# EAGLE design V2b (EAGLE 6.5.0)
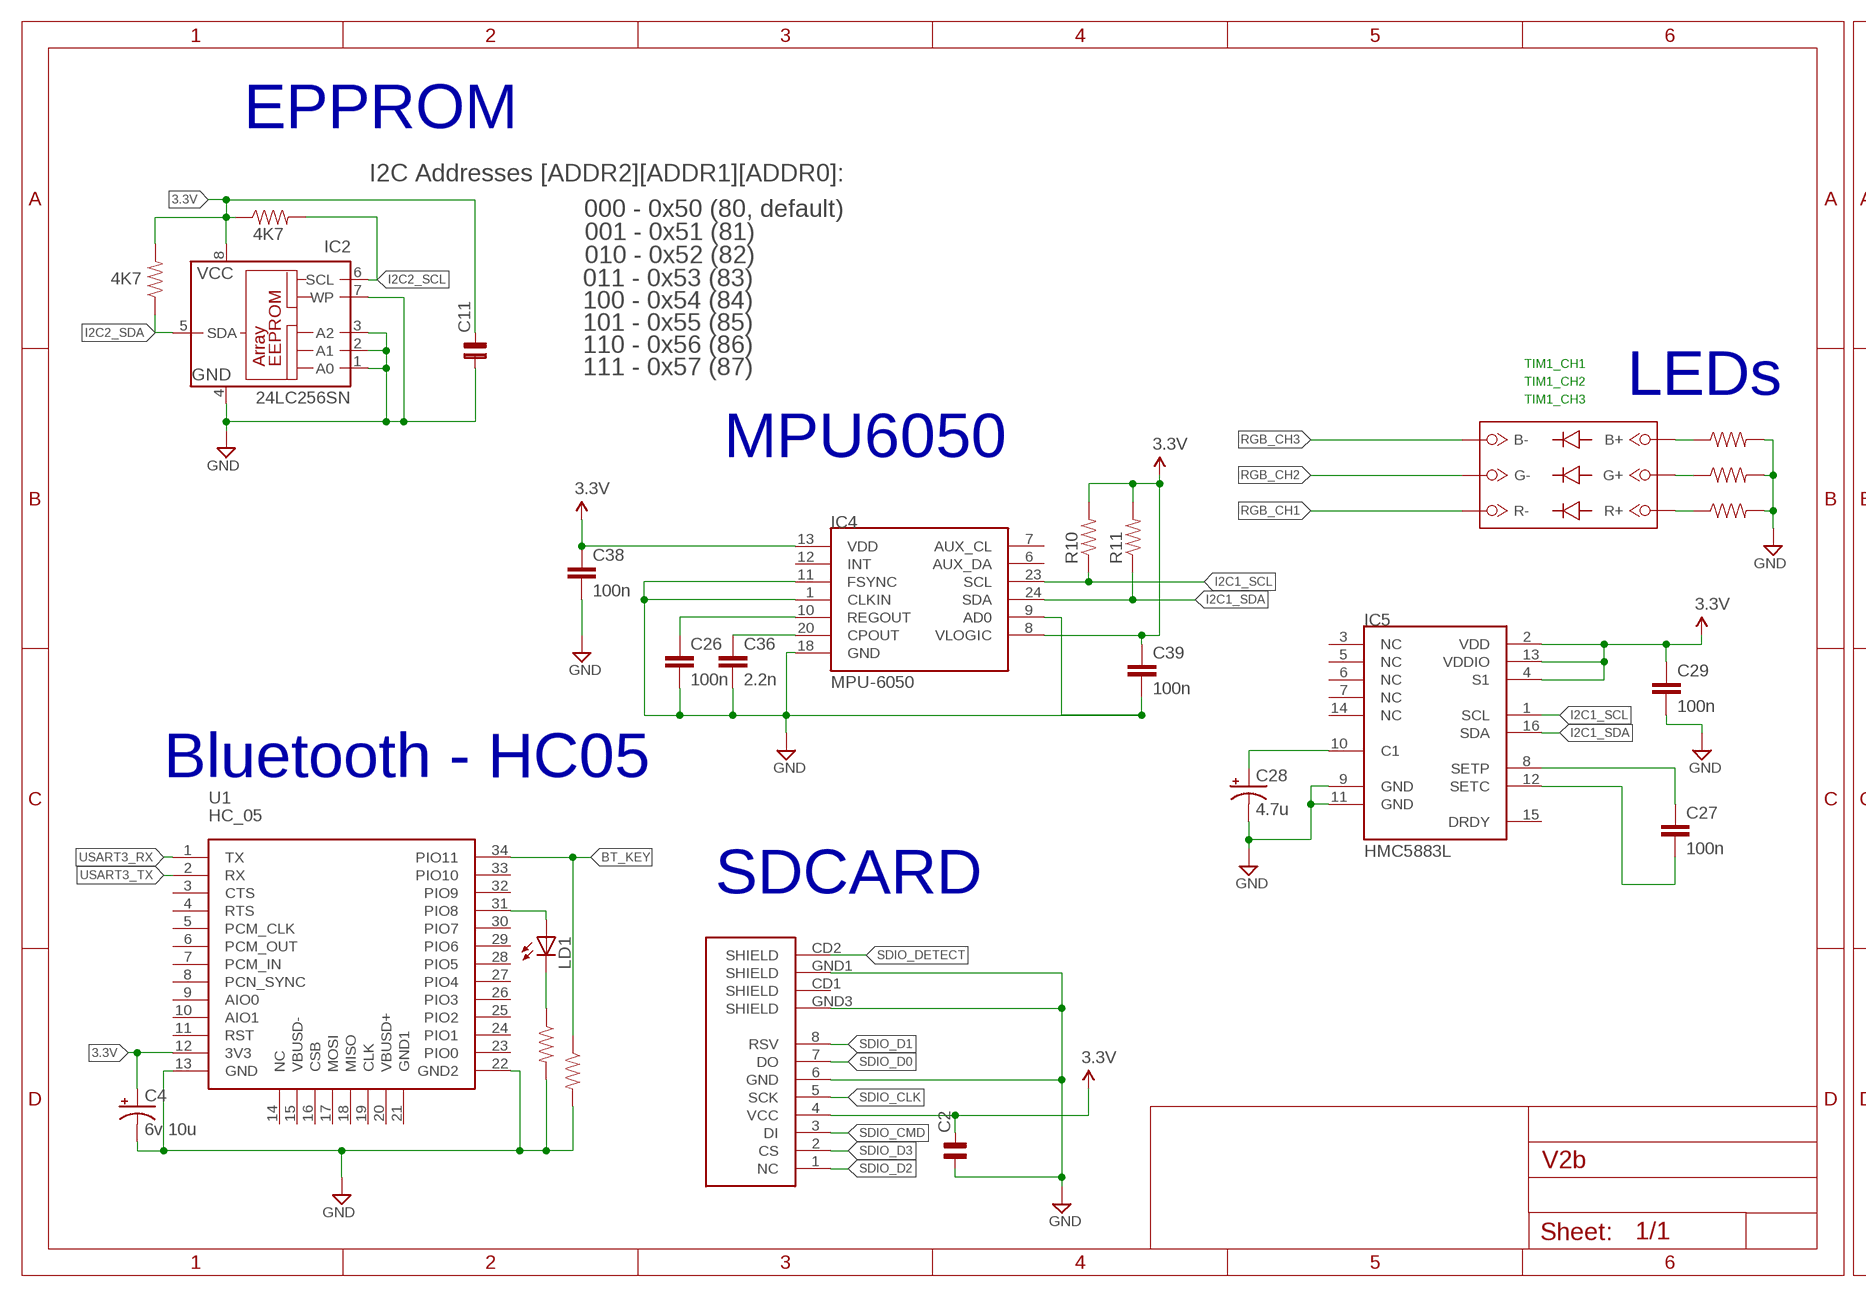
[diagram p0: schematic, sheet 1, part 1 of 2]
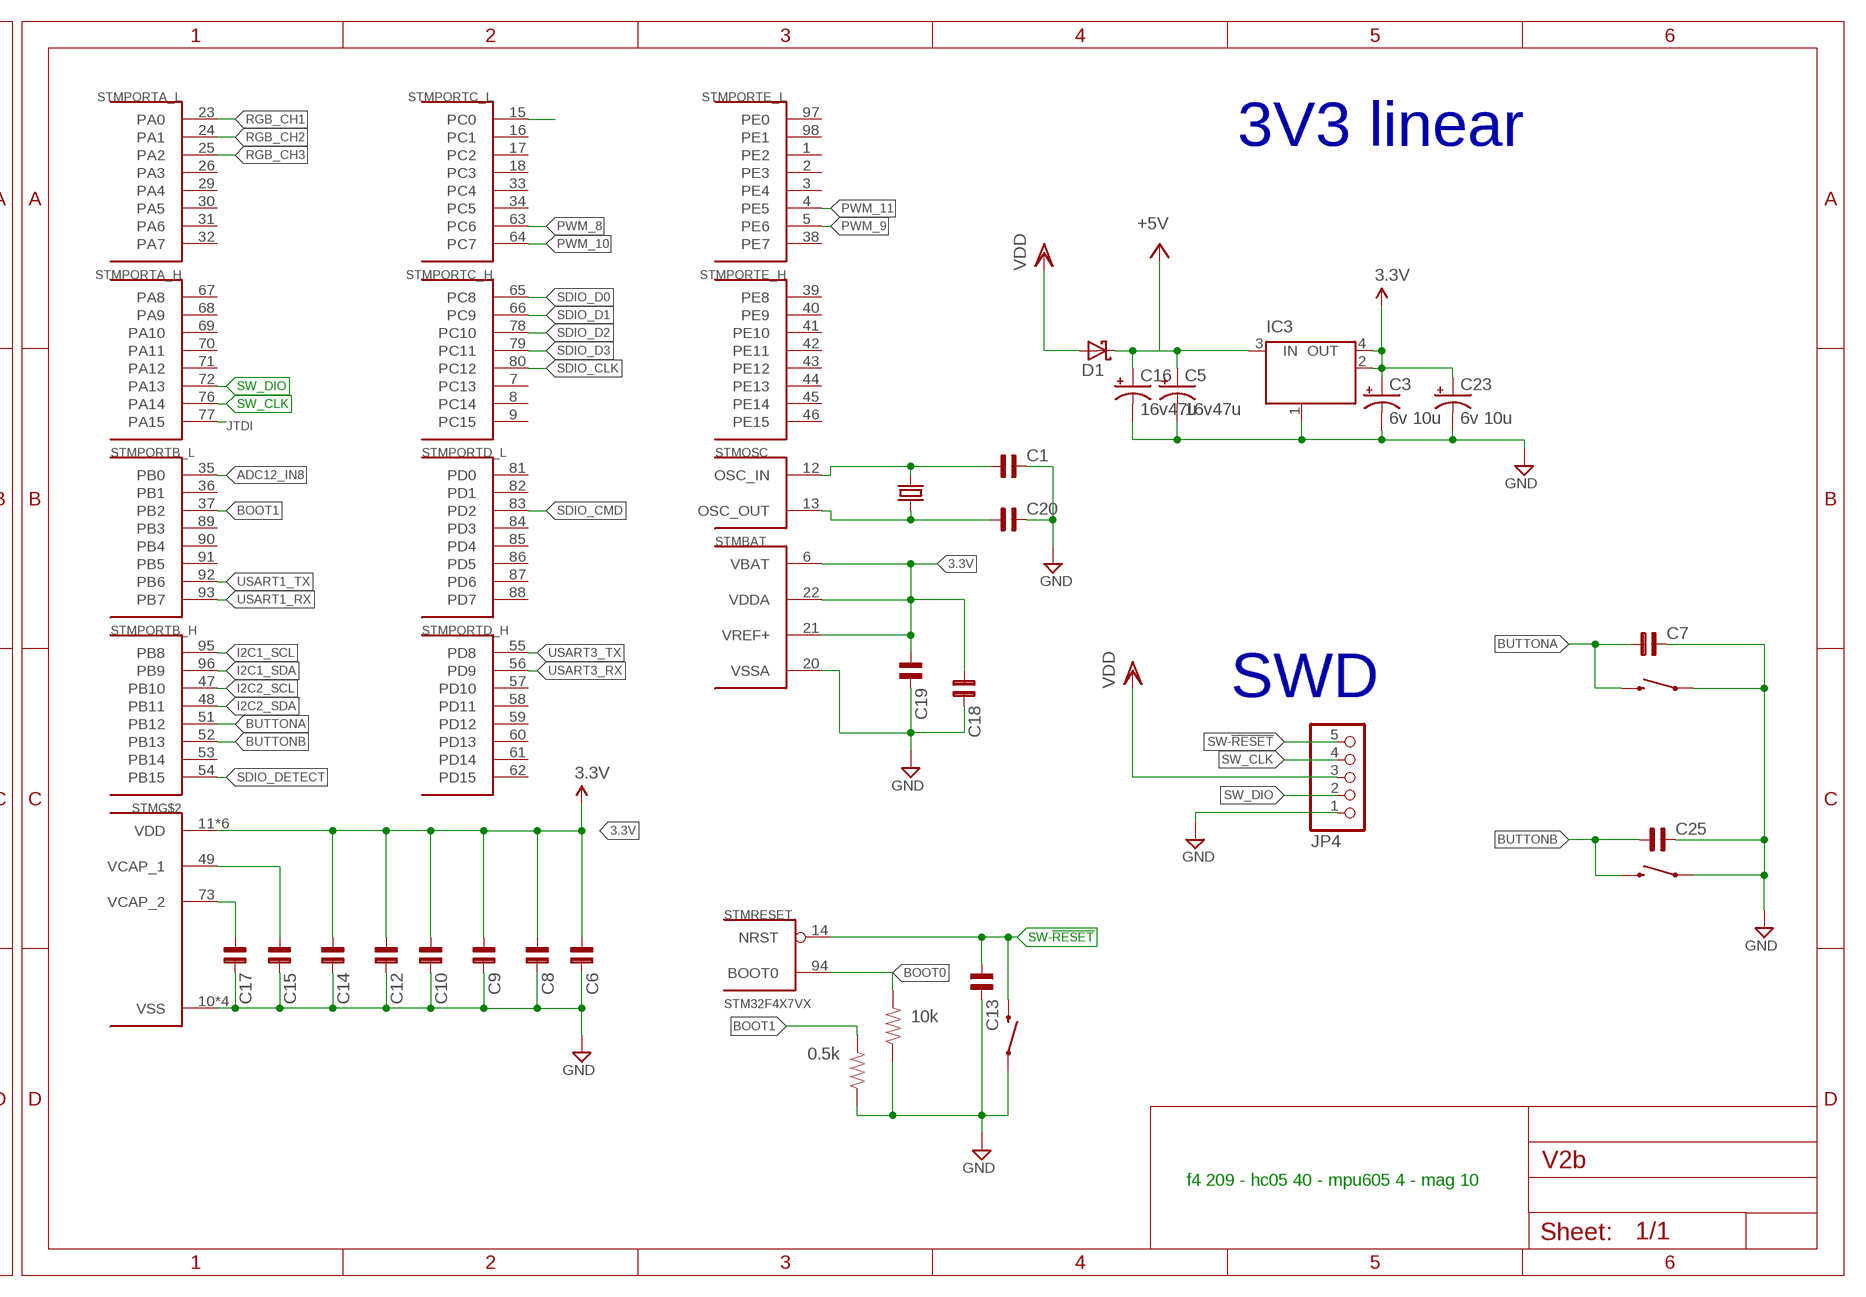
[diagram p1: schematic, sheet 1, part 2 of 2]

## Parts
C1  C-NP-SMD-0603  [C-0603]
C2  C-NP-SMD-0603  [C-0603]
C3  6v 10u  CPOL-USSMCC  [SMC_C]
C4  6v 10u  CPOL-USSMCA  [SMC_A]
C5  16v47u  CPOL-USSMCC  [SMC_C]
C6  C-NP-SMD-0603  [C-0603]
C7  C-NP-SMD-0603  [C-0603]
C8  C-NP-SMD-0603  [C-0603]
C9  C-NP-SMD-0603  [C-0603]
C10  C-NP-SMD-0603  [C-0603]
C11  C-NP-SMD-0603  [C-0603]
C12  C-NP-SMD-0603  [C-0603]
C13  C-NP-SMD-0603  [C-0603]
C14  C-NP-SMD-0603  [C-0603]
C15  C-NP-SMD-0603  [C-0603]
C16  16v47u  CPOL-USSMCC  [SMC_C]
C17  C-NP-SMD-0603  [C-0603]
C18  C-NP-SMD-0603  [C-0603]
C19  C-NP-SMD-0603  [C-0603]
C20  C-NP-SMD-0603  [C-0603]
C23  6v 10u  CPOL-USSMCC  [SMC_C]
C25  C-NP-SMD-0603  [C-0603]
C26  100n  SPARKFUN_CAP0603-CAP  [SPARKFUN_0603-CAP]
C27  100n  SPARKFUN_CAP0603-CAP  [SPARKFUN_0603-CAP]
C28  4.7u  CPOL-USSMCA  [SMC_A]
C29  100n  SPARKFUN_CAP0603-CAP  [SPARKFUN_0603-CAP]
C36  2.2n  SPARKFUN_CAP0603-CAP  [SPARKFUN_0603-CAP]
C38  100n  SPARKFUN_CAP0603-CAP  [SPARKFUN_0603-CAP]
C39  100n  SPARKFUN_CAP0603-CAP  [SPARKFUN_0603-CAP]
D1  MBRS330T3  [SMC]
IC2  24LC256SN  [SO-08]
IC3  LINEAR_MC33269ST-3.3T3  [LINEAR_SOT223]
IC4  MPU-6050  TESTING_MPU-6050-1  [TESTING_QFN-24-4MM2]
IC5  HMC5883L  SPARKFUN_HMC5883LSMD  [SPARKFUN_16LPCC]
JP4  PINHD-1X5_2.54-90°  [1X05/90]
LD1  LEDCHIPLED_0603  [CHIPLED_0603]
R2  10K  SPARKFUN_RESISTOR0603-RES  [SPARKFUN_0603-RES]
R3  10K  SPARKFUN_RESISTOR0603-RES  [SPARKFUN_0603-RES]
R5  10K  SPARKFUN_RESISTOR0603-RES  [SPARKFUN_0603-RES]
R6  10K  SPARKFUN_RESISTOR0603-RES  [SPARKFUN_0603-RES]
R7  10k  SPARKFUN_RESISTOR0603-RES  [SPARKFUN_0603-RES]
R8  0.5k  SPARKFUN_RESISTOR0603-RES  [SPARKFUN_0603-RES]
R9  10K  SPARKFUN_RESISTOR0603-RES  [SPARKFUN_0603-RES]
R10  SPARKFUN_RESISTOR0603-RES  [SPARKFUN_0603-RES]
R11  SPARKFUN_RESISTOR0603-RES  [SPARKFUN_0603-RES]
R15  4K7  SPARKFUN_RESISTOR0603-RES  [SPARKFUN_0603-RES]
R16  4K7  SPARKFUN_RESISTOR0603-RES  [SPARKFUN_0603-RES]
S1  RESET  SWITCH-MOMENTARY-2-SMD-1101NE  [TACTILE-SWITCH-1101NE]
S2  RESET  SWITCH-MOMENTARY-2-SMD-1101NE  [TACTILE-SWITCH-1101NE]
S4  RESET  SWITCH-MOMENTARY-2-SMD-1101NE  [TACTILE-SWITCH-1101NE]
SDCARD2  microSD Socket  USD-SOCKETNEW  [MICRO-SD-SOCKET-PP]
STM  STM32F4X7VX  [TQFP100]
U1  HC_05  [BLUETOOTH_SMD]
U$12  RGB_LED  [SMD]
Y1  CRYSTALHC49US  [HC49US]

## Nets
3.3V: C2.2 C3.+ C4.+ C6.1 C8.1 C9.1 C10.1 C11.2 C12.1 C14.1 C18.1 C19.1 C23.+ C29.1 C38.1 C39.1 IC2.8(VCC) IC3.2(OUT) IC3.4(OUT) IC4.8(VLOGIC) IC4.13(VDD) IC5.2(VDD) IC5.4(S1) IC5.13(VDDIO) R10.2 R11.2 R15.1 R16.2 SDCARD2.4(VCC) STM.6(BAT:VBAT) STM.11(VDD) STM.19(VDD) STM.21(BAT:VREF+) STM.22(BAT:VDDA) STM.28(VDD) STM.50(VDD) STM.75(VDD) STM.100(VDD) U1.12(3V3)
+5V: C5.+ C16.+ D1.C IC3.3(IN)
ADC12_IN8: STM.35(PORTB_L:PB0)
BOOT0: R7.2 STM.94(RESET:BOOT0)
BOOT1: R8.2 STM.37(PORTB_L:PB2)
BT_KEY: R5.1 U1.34(PIO11)
BUTTONA: C7.1 S4.P$2 STM.51(PORTB_H:PB12)
BUTTONB: C25.1 S2.P$2 STM.52(PORTB_H:PB13)
GND: C1.2 C2.1 C3.- C4.- C5.- C6.2 C7.2 C8.2 C9.2 C10.2 C11.1 C12.2 C13.2 C14.2 C15.2 C16.- C17.2 C18.2 C19.2 C20.2 C23.- C25.2 C26.2 C28.- C29.2 C36.2 C38.2 C39.2 IC2.1(A0) IC2.2(A1) IC2.3(A2) IC2.4(GND) IC2.7(WP) IC3.1(GND/ADJ) IC4.1(CLKIN) IC4.9(AD0) IC4.11(FSYNC) IC4.18(GND) IC5.9(GND) IC5.11(GND) JP4.1 R2.2 R3.2 R5.2 R6.2 R7.1 R8.1 R9.2 S1.P$1 S2.P$1 S4.P$1 SDCARD2.6(GND) SDCARD2.GND1(SHIELD) SDCARD2.GND3(SHIELD) STM.10(VSS) STM.20(BAT:VSSA) STM.27(VSS) STM.74(VSS) STM.99(VSS) U1.13(GND) U1.22(GND2)
I2C1_SCL: IC4.23(SCL) IC5.1(SCL) R10.1 STM.95(PORTB_H:PB8)
I2C1_SDA: IC4.24(SDA) IC5.16(SDA) R11.1 STM.96(PORTB_H:PB9)
I2C2_SCL: IC2.6(SCL) R15.2 STM.47(PORTB_H:PB10)
I2C2_SDA: IC2.5(SDA) R16.1 STM.48(PORTB_H:PB11)
JTDI: STM.77(PORTA_H:PA15)
N$1: C1.1 STM.12(OSC:OSC_IN) Y1.2
N$2: R2.1 U$12.B+
N$3: C26.1 IC4.10(REGOUT)
N$4: LD1.A U1.31(PIO8)
N$5: LD1.C R9.1
N$6: R6.1 U$12.R+
N$7: R3.1 U$12.G+
N$8: C36.1 IC4.20(CPOUT)
N$9: STM.15(PORTC_L:PC0)
N$10: C27.1 IC5.8(SETP)
N$12: C28.+ IC5.10(C1)
N$13: C27.2 IC5.12(SETC)
N$29: C20.1 STM.13(OSC:OSC_OUT) Y1.1
N$31: C17.1 STM.73(VCAP_2)
N$32: C15.1 STM.49(VCAP_1)
PWM_8: STM.63(PORTC_L:PC6)
PWM_9: STM.5(PORTE_L:PE6)
PWM_10: STM.64(PORTC_L:PC7)
PWM_11: STM.4(PORTE_L:PE5)
RGB_CH1: STM.23(PORTA_L:PA0) U$12.R-
RGB_CH2: STM.24(PORTA_L:PA1) U$12.G-
RGB_CH3: STM.25(PORTA_L:PA2) U$12.B-
SDIO_CLK: SDCARD2.5(SCK) STM.80(PORTC_H:PC12)
SDIO_CMD: SDCARD2.3(DI) STM.83(PORTD_L:PD2)
SDIO_D0: SDCARD2.7(DO) STM.65(PORTC_H:PC8)
SDIO_D1: SDCARD2.8(RSV) STM.66(PORTC_H:PC9)
SDIO_D2: SDCARD2.1(NC) STM.78(PORTC_H:PC10)
SDIO_D3: SDCARD2.2(CS) STM.79(PORTC_H:PC11)
SDIO_DETECT: SDCARD2.CD2(SHIELD) STM.54(PORTB_H:PB15)
SW-!RESET: C13.1 JP4.5 S1.P$2 STM.14(RESET:NRST)
SW_CLK: JP4.4 STM.76(PORTA_H:PA14)
SW_DIO: JP4.2 STM.72(PORTA_H:PA13)
USART1_RX: STM.93(PORTB_L:PB7)
USART1_TX: STM.92(PORTB_L:PB6)
USART3_RX: STM.56(PORTD_H:PD9) U1.1(TX)
USART3_TX: STM.55(PORTD_H:PD8) U1.2(RX)
VDD: D1.A JP4.3
Unconnected: IC4.6(AUX_DA) IC4.7(AUX_CL) IC4.12(INT) IC5.3(NC) IC5.5(NC) IC5.6(NC) IC5.7(NC) IC5.14(NC) IC5.15(DRDY) SDCARD2.CD1(SHIELD) STM.1(PORTE_L:PE2) STM.2(PORTE_L:PE3) STM.3(PORTE_L:PE4) STM.7(PORTC_H:PC13) STM.8(PORTC_H:PC14) STM.9(PORTC_H:PC15) STM.16(PORTC_L:PC1) STM.17(PORTC_L:PC2) STM.18(PORTC_L:PC3) STM.26(PORTA_L:PA3) STM.29(PORTA_L:PA4) STM.30(PORTA_L:PA5) STM.31(PORTA_L:PA6) STM.32(PORTA_L:PA7) STM.33(PORTC_L:PC4) STM.34(PORTC_L:PC5) STM.36(PORTB_L:PB1) STM.38(PORTE_L:PE7) STM.39(PORTE_H:PE8) STM.40(PORTE_H:PE9) STM.41(PORTE_H:PE10) STM.42(PORTE_H:PE11) STM.43(PORTE_H:PE12) STM.44(PORTE_H:PE13) STM.45(PORTE_H:PE14) STM.46(PORTE_H:PE15) STM.53(PORTB_H:PB14) STM.57(PORTD_H:PD10) STM.58(PORTD_H:PD11) STM.59(PORTD_H:PD12) STM.60(PORTD_H:PD13) STM.61(PORTD_H:PD14) STM.62(PORTD_H:PD15) STM.67(PORTA_H:PA8) STM.68(PORTA_H:PA9) STM.69(PORTA_H:PA10) STM.70(PORTA_H:PA11) STM.71(PORTA_H:PA12) STM.81(PORTD_L:PD0) STM.82(PORTD_L:PD1) STM.84(PORTD_L:PD3) STM.85(PORTD_L:PD4) STM.86(PORTD_L:PD5) STM.87(PORTD_L:PD6) STM.88(PORTD_L:PD7) STM.89(PORTB_L:PB3) STM.90(PORTB_L:PB4) STM.91(PORTB_L:PB5) STM.97(PORTE_L:PE0) STM.98(PORTE_L:PE1) U1.3(CTS) U1.4(RTS) U1.5(PCM_CLK) U1.6(PCM_OUT) U1.7(PCM_IN) U1.8(PCN_SYNC) U1.9(AIO0) U1.10(AIO1) U1.11(RST) U1.14(NC) U1.15(VBUSD-) U1.16(CSB) U1.17(MOSI) U1.18(MISO) U1.19(CLK) U1.20(VBUSD+) U1.21(GND1) U1.23(PIO0) U1.24(PIO1) U1.25(PIO2) U1.26(PIO3) U1.27(PIO4) U1.28(PIO5) U1.29(PIO6) U1.30(PIO7) U1.32(PIO9) U1.33(PIO10)

## Notes on the sheet
- EPPROM | 3V3 linear
- I2C Addresses [ADDR2][ADDR1][ADDR0]:
- 000 - 0x50 (80, default)
- 001 - 0x51 (81)
- 010 - 0x52 (82)
- 011 - 0x53 (83)
- 100 - 0x54 (84)
- 101 - 0x55 (85)
- 110 - 0x56 (86)
- TIM1_CH1
- 111 - 0x57 (87)
- TIM1_CH2
- LEDs
- TIM1_CH3
- MPU6050
- SWD
- Bluetooth - HC05
- SDCARD
- f4 209 - hc05 40 - mpu605 4 - mag 10
- TJA1040

## Library data of the parts
C1 C2 C6-C15 C17-C20 C25 = cap-pan40:C-NP: NON-POLARIZED FILM/CHIP
C3-C5 C16 C23 C28 = rcl:CPOL-US: POLARIZED CAPACITOR, American symbol
C26 C27 C29 C36 C38 C39 = Helios_RLC:SPARKFUN_CAP: Capacitor Standard 0603 ceramic capacitor, and 0.1" leaded capacitor.
D1 = Robotech Diode of Chung:MBRS3*0T3: SCHOTTKY BARRIER RECTIFIER 3.0 AMPERES 20, 30, 40 VOLT Source: MBRS340T3-D.pdf
IC2 = microchip:24*: Serial EEPROM I2C; DIGIKEY: 24LC256-E/SN-ND; MF: MICROCHIP; MPN: 24LC256-I/SN; OC_FARNELL: 9757996; OC_NEWARK: 27C9144
IC3 = Robotech_Other:LINEAR_MC33269ST*: Adjustable Output Low Dropout Voltage Regulator 800 mA Source: http://www.onsemi.com/pub/Collateral/MC33269-D.PDF
IC4 = Helios_IMU:TESTING_MPU-6050
IC5 = Helios_IMU:SPARKFUN_HMC5883L: 3 Axis Digital Compass IC
JP4 = pinhead-1:PINHD-1X5: PIN HEADER
LD1 = led:LED: LED OSRAM: - CHIPLED LG R971, LG N971, LY N971, LG Q971, LY Q971, LO R971, LY R971 LH N974, LH R974 LS Q976, LO Q976, LY Q976 LO Q996 - Hyper CHIPLED LW Q18S LB Q993, LB Q99A, LB R99A - SideLED LS A670, LO A670, LY A670, LG A670, LP A670 LB A673, LV A673, LT A673, LW A673 LH A674 LY A675 LS A676, LA A676, LO A676, LY A676, LW A676 LS A679, LY A679, LG A679 - Hyper Micro SIDELED® LS Y876, LA Y876, LO Y876, LY Y876 LT Y87S - SmartLED LW L88C, LW L88S LB L89C, LB L89S, LG L890 LS L89K, LO L89K, LY L89K LS L896, LA L896, LO L896, LY L896 - TOPLED LS T670, LO T670, LY T670, LG T670, LP T670 LSG T670, LSP T670, LSY T670, LOP T670, LYG T670 LG T671, LOG T671, LSG T671 LB T673, LV T673, LT T673, LW T673 LH T674 LS T676, LA T676, LO T676, LY T676, LB T676, LH T676, LSB T676, LW T676 LB T67C, LV T67C, LT T67C, LS T67K, LO T67K, LY T67K, LW E67C LS E67B, LA E67B, LO E67B, LY E67B, LB E67C, LV E67C, LT E67C LW T67C LS T679, LY T679, LG T679 LS T770, LO T770, LY T770, LG T770, LP T770 LB T773, LV T773, LT T773, LW T773 LH T774 LS E675, LA E675, LY E675, LS T675 LS T776, LA T776, LO T776, LY T776, LB T776 LHGB T686 LT T68C, LB T68C - Hyper Mini TOPLED® LB M676 - Mini TOPLED Santana® LG M470 LS M47K, LO M47K, LY M47K Source: http://www.osram.convergy.de/
R2 R3 R5-R9 R15 R16 = Robotech_RCL:SPARKFUN_RESISTOR: Resistor Basic schematic elements and footprints for 0603, 1206, and PTH resistors.
R10 R11 = Helios_RLC:SPARKFUN_RESISTOR: Resistor Basic schematic elements and footprints for 0603, 1206, and PTH resistors.
S1 S2 S4 = pixhawk2:SWITCH-MOMENTARY-2; PARTNO: EVQ-P7J01P
SDCARD2 = SparkFun:USD-SOCKET: microSD Socket Push-push type uSD socket. Schematic element and footprint production proven. Spark Fun Electronics SKU : PRT-00127. tDoc lines correctly indicate media card edge positions when inserting (unlocked, locked, depressed).
STM = pixhawk2:STM32F4X7VX: STM32F4X7VX 100 pin LQFP STM32F407VE - 512 KB flash, no crypto STM32F407VG - 1 MB flash, no crypto STM32F417VE - 512 KB flash, with crypto STM32F417VG - 1 MB flash, with crypto; PARTNO: STM32F427VI
U1 = SerialPortBluetooth:HC_05
U$12 = RGB_LED:RGB_LED
Y1 = SparkFun-FreqCtrl:CRYSTAL: Various standard crystals. Proven footprints. Spark Fun Electronics SKU : COM-00534

## Net classes
1 power: width 0.15 mm, drill 0.2 mm, clearance 0.152 mm

## Board
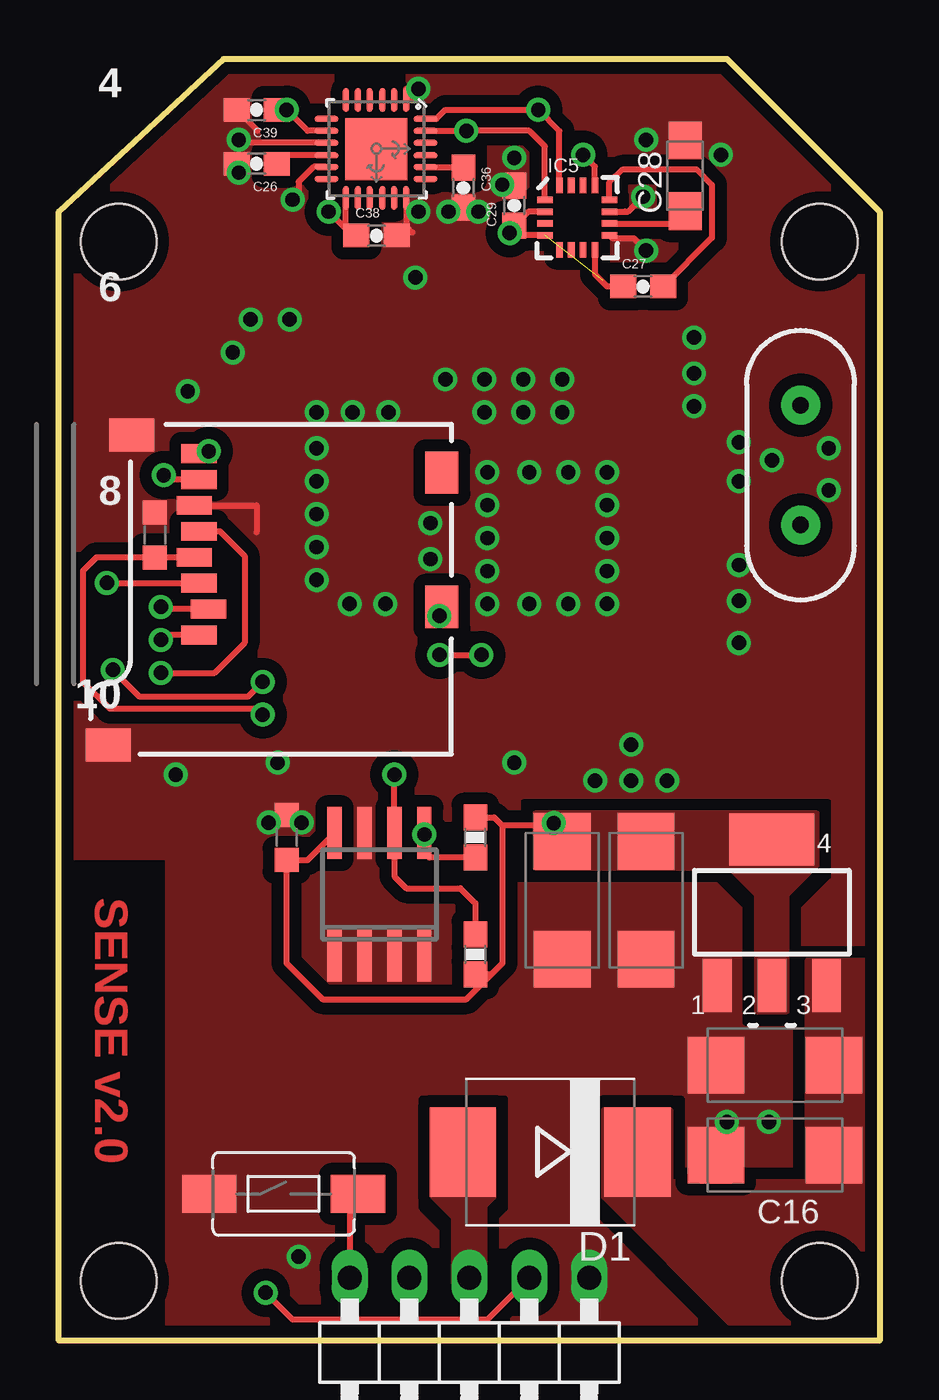
[diagram p2: board, top side]
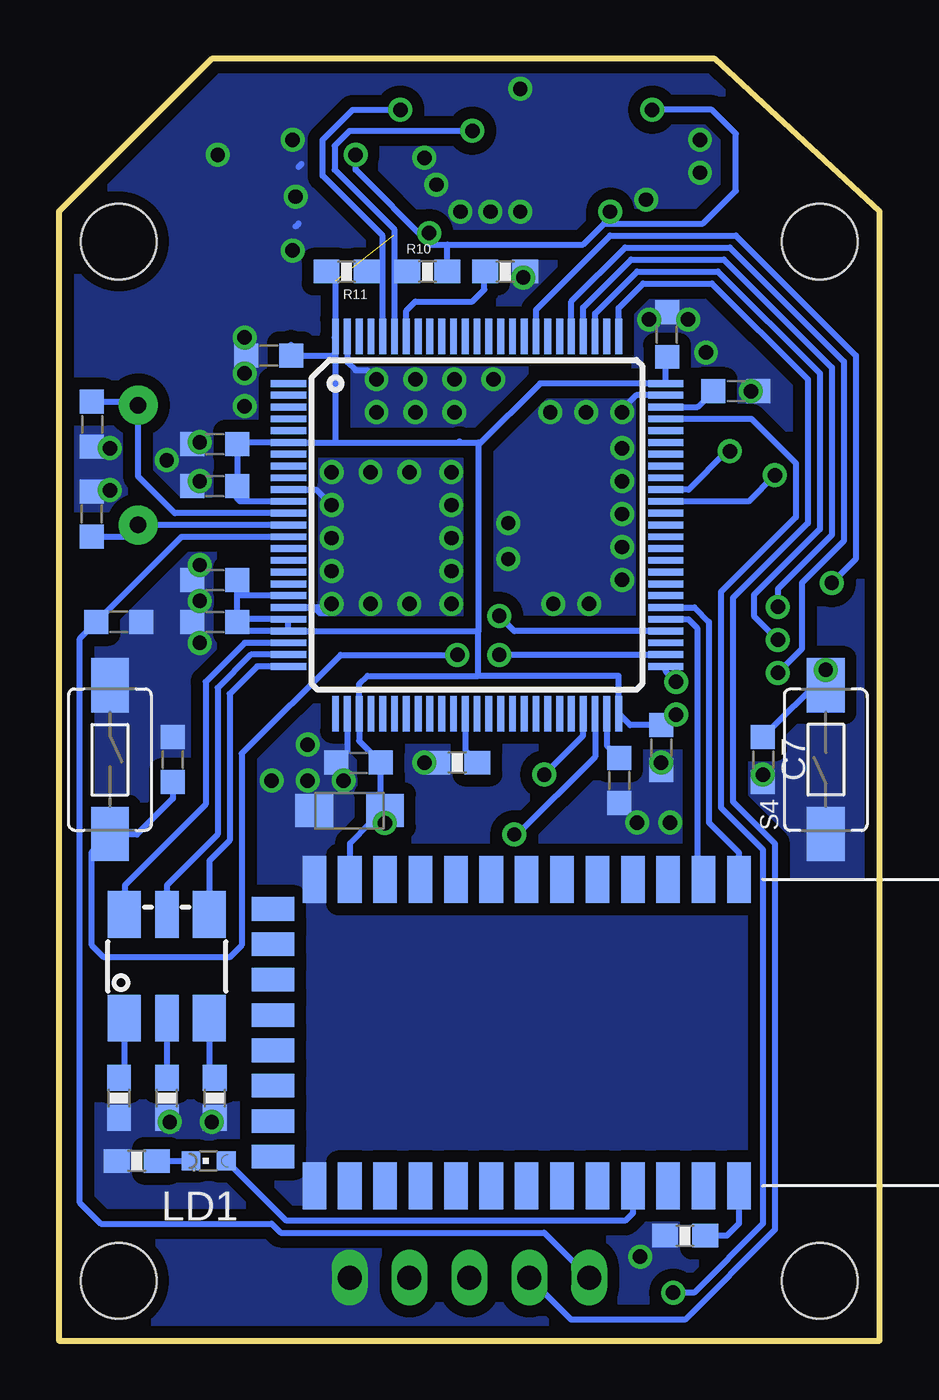
[diagram p3: board, bottom side, seen from below]

Size 34.8 x 54.36 mm. Coordinates in mm from the lower left corner, seen from the top.
Outline: 34.8,0 0,0 0,47.88 6.99,54.36 28.32,54.36 34.8,47.88 34.8,0
Copper layers (1*16): Top 0.035mm / dielectric 1.5mm / Bottom 0.035mm
Design rules "default *": minimum track width 10mil, minimum drill 24mil, track to track 8mil, track to pad 8mil, pad to pad 8mil, via to via 10mil, smd to smd 8mil, copper to edge 20mil, drill to drill 10mil, minimum pad ring 10mil, minimum via ring 8mil, stop-mask expansion 0mil, vias tented up to drill 100mil, thermal gap 10mil
Holes 3.2 mm at 2.54,2.54 2.54,46.61 32.26,46.61 32.26,2.54
bKeepout: area -1,43.1 to 6,50.1; area -1,-1 to 6,6; area 28.8,-1 to 35.8,6; area 28.8,43.1 to 35.8,50.1

### Footprints (pad centres in the part's own frame; a part is rotated, then mirrored left to right if it is on the bottom)
C-0603 = smd 1.016 x 1.016: 1 -0.953,0; 2 0.953,0
SMC_C = smd 2.4 x 2.4: + -2.5,0; - 2.5,0
SMC_A = smd 1.6 x 1.4: + -1.5,0; - 1.5,0
SPARKFUN_0603-CAP = smd 1.1 x 1: 1 -0.85,0; 2 0.85,0
SMC = smd 2.8 x 3.8: A 3.7,0; C -3.7,0
SO-08 = smd 0.6 x 2.2: 1 -1.905,-2.6; 2 -0.635,-2.6; 3 0.635,-2.6; 4 1.905,-2.6; 5 1.905,2.6; 6 0.635,2.6; 7 -0.635,2.6; 8 -1.905,2.6
LINEAR_SOT223 = smd 1.219 x 2.235: 1 -2.311,-3.099; 2 0,-3.099; 3 2.311,-3.099 | smd 3.6 x 2.2: 4 0,3.099
TESTING_QFN-24-4MM2 = smd 1.016 x 0.254: 1 -2.066,1.257; 2 -2.066,0.75; 3 -2.066,0.247; 4 -2.066,-0.287; 5 -2.066,-0.792; 6 -2.066,-1.297; 13 2.086,-1.297; 14 2.086,-0.792; 15 2.086,-0.287; 16 2.086,0.247; 17 2.086,0.75; 18 2.086,1.257 | smd 0.254 x 1.016: 7 -1.267,-2.122; 8 -0.762,-2.122; 9 -0.258,-2.122; 10 0.278,-2.122; 11 0.78,-2.122; 12 1.287,-2.122; 19 1.287,2.082; 20 0.78,2.082; 21 0.278,2.082; 22 -0.258,2.082; 23 -0.762,2.082; 24 -1.267,2.082 | smd 2.616 x 2.616: P$1 0.02,-0.01
SPARKFUN_16LPCC = smd 0.65 x 0.28: 1 -1.37,0.75; 2 -1.37,0.25; 3 -1.37,-0.25; 4 -1.37,-0.75; 9 1.37,-0.75; 10 1.37,-0.25; 11 1.37,0.25; 12 1.37,0.75 | smd 0.28 x 0.65: 5 -0.75,-1.37; 6 -0.25,-1.37; 7 0.25,-1.37; 8 0.75,-1.37; 13 0.75,1.37; 14 0.25,1.37; 15 -0.25,1.37; 16 -0.75,1.37
1X05/90 = drill 1.016 long: 1 -5.08,-3.81; 2 -2.54,-3.81; 3 0,-3.81; 4 2.54,-3.81; 5 5.08,-3.81
CHIPLED_0603 = smd 0.8 x 0.8: A 0,-0.75; C 0,0.75
SPARKFUN_0603-RES = smd 1.1 x 1: 1 -0.85,0; 2 0.85,0
TACTILE-SWITCH-1101NE = smd 2.3 x 1.6: P$1 -3.15,0; P$2 3.15,0
MICRO-SD-SOCKET-PP = smd 0.8 x 1.5: 1 -8.94,10.7; 2 -7.84,10.3; 3 -6.74,10.7; 4 -5.64,10.9; 5 -4.54,10.7; 6 -3.44,10.9; 7 -2.34,10.7; 8 -1.24,10.7 | smd 1.8 x 1.4: CD1 -2.05,0.4; CD2 -7.75,0.4 | smd 1.4 x 1.9: GND1 -13.6,14.55; GND3 -0.45,13.55
TQFP100 = smd 1.5 x 0.29: 1 -8,6; 2 -8,5.5; 3 -8,5; 4 -8,4.5; 5 -8,4; 6 -8,3.5; 7 -8,3; 8 -8,2.5; 9 -8,2; 10 -8,1.5; 11 -8,1; 12 -8,0.5; 13 -8,0; 14 -8,-0.5; 15 -8,-1; 16 -8,-1.5; 17 -8,-2; 18 -8,-2.5; 19 -8,-3; 20 -8,-3.5; 21 -8,-4; 22 -8,-4.5; 23 -8,-5; 24 -8,-5.5; 25 -8,-6; 51 8,-6; 52 8,-5.5; 53 8,-5; 54 8,-4.5; 55 8,-4; 56 8,-3.5; 57 8,-3; 58 8,-2.5; 59 8,-2; 60 8,-1.5; 61 8,-1; 62 8,-0.5; 63 8,0; 64 8,0.5; 65 8,1; 66 8,1.5; 67 8,2; 68 8,2.5; 69 8,3; 70 8,3.5; 71 8,4; 72 8,4.5; 73 8,5; 74 8,5.5; 75 8,6 | smd 0.29 x 1.5: 26 -6,-8; 27 -5.5,-8; 28 -5,-8; 29 -4.5,-8; 30 -4,-8; 31 -3.5,-8; 32 -3,-8; 33 -2.5,-8; 34 -2,-8; 35 -1.5,-8; 36 -1,-8; 37 -0.5,-8; 38 0,-8; 39 0.5,-8; 40 1,-8; 41 1.5,-8; 42 2,-8; 43 2.5,-8; 44 3,-8; 45 3.5,-8; 46 4,-8; 47 4.5,-8; 48 5,-8; 49 5.5,-8; 50 6,-8; 76 6,8; 77 5.5,8; 78 5,8; 79 4.5,8; 80 4,8; 81 3.5,8; 82 3,8; 83 2.5,8; 84 2,8; 85 1.5,8; 86 1,8; 87 0.5,8; 88 0,8; 89 -0.5,8; 90 -1,8; 91 -1.5,8; 92 -2,8; 93 -2.5,8; 94 -3,8; 95 -3.5,8; 96 -4,8; 97 -4.5,8; 98 -5,8; 99 -5.5,8; 100 -6,8
BLUETOOTH_SMD = smd 2 x 1: 1 0,0; 2 0,-1.5; 3 0,-3; 4 0,-4.5; 5 0,-6; 6 0,-7.5; 7 0,-9; 8 0,-10.5; 9 0,-12; 10 0,-13.5; 11 0,-15; 12 0,-16.5; 13 0,-18; 22 13,-18; 23 13,-16.5; 24 13,-15; 25 13,-13.5; 26 13,-12; 27 13,-10.5; 28 13,-9; 29 13,-7.5; 30 13,-6; 31 13,-4.5; 32 13,-3; 33 13,-1.5; 34 13,0 | smd 1 x 1.8: 14 1.25,-19.75; 15 2.75,-19.75; 16 4.25,-19.75; 17 5.75,-19.75; 18 7.25,-19.75; 19 8.75,-19.75; 20 10.25,-19.75; 21 11.75,-19.75
SMD = smd 1.99 x 1.4: B+ -2.2,-1.8; B- 2.2,-1.8; R+ -2.2,1.8; R- 2.2,1.8 | smd 1.99 x 1: G+ -2.2,0; G- 2.2,0
HC49US = drill 0.7 pad 1.651: 1 -2.54,0; 2 2.54,0

### Placement (x,y rotation side)
C1  33.4,38.86 270 bottom
C2  4.06,34.16 270 top
C3  24.89,18.67 270 top
C4  22.48,22.48 180 bottom
C5  30.35,11.68 180 top
C6  28.19,30.48 180 bottom
C7  4.95,24.64 270 bottom
C8  28.19,32.26 180 bottom
C9  28.19,36.25 180 bottom
C10  28.19,38.02 180 bottom
C11  9.65,21.34 270 top
C12  25.91,41.78 180 bottom
C13  32.26,30.48 0 bottom
C14  22.1,24.51 180 bottom
C15  11.05,23.75 270 bottom
C16  30.35,7.87 180 top
C17  6.1,40.26 0 bottom
C18  9.27,25.15 270 bottom
C19  9.02,42.67 90 bottom
C20  33.4,35.05 90 bottom
C23  21.34,18.67 270 top
C25  29.97,24.64 90 bottom
C26  8.38,49.91 180 top
C27  24.77,44.7 0 top
C28  26.54,49.4 90 top
C29  19.3,48.13 90 top
C36  17.14,48.89 270 top
C38  13.46,46.86 0 top
C39  8.38,52.2 180 top
D1  20.83,8 180 top
IC2  13.59,18.92 0 top
IC3  30.23,18.16 0 top
IC4  13.46,50.55 270 top
IC5  21.97,47.62 0 top
JP4  17.4,-1.14 180 top
LD1  28.45,7.62 90 bottom
R2  28.19,10.29 270 bottom
R3  30.23,10.29 270 bottom
R5  8.25,4.45 180 bottom
R6  32.26,10.29 270 bottom
R7  15.87,45.34 180 bottom
R8  17.91,24.51 0 bottom
R9  31.5,7.62 180 bottom
R10  19.18,45.34 0 bottom
R11  22.61,45.34 180 bottom
R15  17.65,16.38 90 top
R16  17.65,21.34 90 top
S1  9.52,6.22 0 top
S2  32.64,24.64 270 bottom
S4  2.29,24.64 90 bottom
SDCARD2  16.64,38.86 90 top
STM  17.07,34.59 0 bottom
U1  5.97,19.56 270 bottom
U$12  30.23,15.87 90 bottom
Y1  31.44,37.13 90 top

### Tracks (layer width: path | path; a pad name or v marks a point on that pad's centre or on a via)
3.3V  (via drill 0.61)  (1 unrouted)
  Top 0.254: IC4.13 12.16,47.31 C38.1 12.45,46.86 v11.43,47.88 | IC5.2 19.9,47.88 C29.1 19.3,47.18 v19.1,46.97 | R16.2 18.45,22.19 18.8,21.84 | 18.8,21.84 18.8,16 18.33,15.53 | 18.33,15.53 R15.1 | 18.33,15.53 17.27,14.48 11.18,14.48 9.65,16 C11.2 10.54,20.38 IC2.8 | IC5.13 22.72,49.8 v22.23,50.29 | SDCARD2.4 5.73,33.21 C2.2 1.59,33.21 1.02,32.64 1.02,27.94 2.16,26.8 8.38,26.8 v8.64,26.54 | v20.98,21.95 20.88,21.84 18.8,21.84 | 19.1,46.68 v19.1,46.97 | IC5.4 19.2,46.88 v19.1,46.97 | C39.1 v9.65,52.2 10.54,51.31 IC4.8
  Bottom 0.254: C10.1 27.24,37.96 | 27.24,37.96 C9.1 27.24,35.72 27.11,35.59 STM.11 | STM.100 23.12,42.54 | 27.24,37.96 27.11,38.09 STM.6 23.07,38.09 | 23.07,38.09 23.07,41.91 | 23.07,41.91 STM.100 | STM.22 17.02,30.09 | STM.22 STM.21 25.09,30.61 27.24,30.61 | 17.02,37.97 17.02,38.09 17.78,38.09 | 17.02,37.97 17.02,30.09 | 23.07,38.09 17.78,38.09 | 17.02,28.19 11.07,28.19 STM.50 10.58,26.1 C18.1 | 17.02,28.19 17.02,30.09 | 17.02,28.19 21.72,28.19 22.07,27.84 STM.28 22.07,25.44 C14.1 21.15,22.65 C4.+ v20.98,21.95 21.61,21.95 22.47,21.09 U1.12 | 17.02,37.97 14.4,40.59 STM.75 9.07,41.66 C19.1 | 23.07,41.91 23.2,41.78 C12.1 24.96,42.23 | 17.82,38.13 17.78,38.09 | STM.22 27.3,30.09 | STM.19 27.24,31.59 C8.1 27.24,30.61 | 19.05,46.48 18.33,46.48 | 18.33,46.48 12.57,46.48 11.68,47.37 | C6.1 27.24,30.61 | 9.14,26.23 C18.1 | v8.64,26.54 9.08,26.1 C18.1 | 23.5,45.3 R11.2 23.07,44.95 STM.100 | v22.23,50.29 22.23,49.66 19.05,46.48 | R10.2 18.33,46.48 | 19.05,46.48 19.05,46.92 v19.1,46.97 | 11.68,47.37 7.49,47.37 6.1,48.77 6.1,51.18 7.11,52.2 v9.65,52.2 | 11.68,47.37 11.43,47.62 v11.43,47.88
  pour Top (isolate 0.508, no thermals): 20.19,20.07 28.45,20.07 29.59,18.92 29.59,13.97 30.86,13.97 30.86,18.92 32.13,20.19 32.13,22.35 20.19,22.35
+5V
  pour Top (isolate 0.508, no thermals): 31.75,16.13 34.16,16.13 34.16,6.73 34.04,6.73 34.04,0.64 28.58,0.64 23.11,6.1 23.11,9.78 25.91,9.78 25.91,6.73 31.75,6.73
BOOT0
  Bottom 0.254: STM.94 20.07,43.68 19.69,44.07 17.27,44.07 16.76,44.58 16.76,45.3 R7.2
BOOT1
  Bottom 0.254: STM.37 17.57,25.03 R8.2
BT_KEY
  Bottom 0.254: U1.34 5.97,4.95 6.48,4.45 R5.1
BUTTONA  (via drill 0.61)
  Top 0.254: v8.64,27.94 8,27.3 3.43,27.3 v2.29,28.45
  Bottom 0.254: 9.03,28.59 STM.51 9.07,28.38 v8.64,27.94 | C7.1 2.29,28.26 v2.29,28.45 S4.P$2
BUTTONB  (via drill 0.61)
  Top 0.254: v16.13,29.08 v17.91,29.08
  Bottom 0.254: v16.13,29.08 16.12,29.09 STM.52 | v17.91,29.08 22.86,29.08 27.05,24.89 27.05,16.76 27.56,16.26 32.89,16.26 33.4,16.76 33.4,20.73 S2.P$2 32.61,21.46 31.5,21.46 29.97,22.99 C25.1
GND  (via drill 0.61)
  Top 0.254: 7.62,52.11 C39.2 8.42,51.31 | IC5.11 24,47.88 24.13,47.88 v24.77,48.51 | 15.15,52.61 IC4.1 14.72,53.07 15.11,53.47 | SDCARD2.6 8.38,35.42 8.38,34.29 | v24.89,46.23 24.38,46.74 23.48,46.74 IC5.9 | IC4.18 14.72,47.26 14.99,46.99 14.44,46.99 C38.2 | IC4.9 7.74,50.8 v7.62,50.93 | IC4.11 11.32,49.77 11.3,49.78 10.79,49.78 10.16,49.15 10.16,48.51
  Bottom 0.254: 23.11,30.86 23.75,30.86 23.98,31.09 STM.20 23.52,31.09 | STM.74 10.33,40.09 10.92,39.5 | STM.99 22.57,41.49 22.23,41.15 21.72,41.15 v21.34,40.77 | STM.10 23.9,36.09 v23.24,35.43 | 24.64,47.37 24.77,47.24 | 24.64,49.78 24.51,49.91 | STM.27 22.57,24.99 C14.2
  other vias: 23.24,36.83 23.24,32.64 23.24,34.04 23.24,31.24 10.92,39.37 18.03,39.37 21.34,39.37 19.69,39.37 18.03,40.77 19.69,40.77 26.92,42.54 28.83,31.37 28.83,32.89 28.83,36.45 28.83,38.1 9.78,43.31 24.89,50.93 19.3,50.16 16.51,47.88 19.3,24.51 32.64,36.07 32.64,37.85 12.45,39.37 13.97,39.37 8.13,43.31 18.8,49.02 28.07,50.29 15.24,53.09 10.29,21.97 9.27,24.51 8.89,21.97 28.83,29.59 7.62,49.53 15.24,47.88 15.11,45.09 17.78,47.88 30.1,9.27 28.32,9.27 4.95,24 24.26,25.27 25.78,23.75 24.26,23.75 22.73,23.75 18.16,36.83 18.16,32.64 18.16,34.04 18.16,35.43 18.16,31.24 19.94,31.24 21.59,31.24 19.94,36.83 21.59,36.83 30.23,37.34 16.38,40.77 10.92,37.85 10.92,33.65 10.92,35.05 10.92,36.45 10.92,32.26 12.32,31.24 13.84,31.24 15.75,33.15 15.75,34.67 26.92,39.62 26.92,41.02 7.37,41.91 5.46,40.26 9.91,48.39 10.16,3.56
  pour Bottom (isolate 0.508, rank 6, no thermals): 4.95,19.69 -8,19.69 -8,54.74 34.92,54.74 35.05,-0.25 5.08,-0.25
  pour Top (isolate 0.508, rank 6, no thermals): 4.7,-7.62 35.05,-7.62 35.05,54.48 -0.25,54.48 -0.25,20.57 4.7,20.57
I2C1_SCL  (via drill 0.61)
  Top 0.254: IC4.23 | IC4.23 v17.27,51.31 19.94,51.31 20.6,50.65 IC5.1
  Bottom 0.254: STM.95 20.57,45.34 | 20.57,45.34 20.57,47.11 23.11,49.66 23.11,50.67 22.48,51.31 v17.27,51.31 | R10.1 20.57,45.34
I2C1_SDA  (via drill 0.61)
  Top 0.254: v20.32,52.2 v20.33,52.2 | v20.32,52.2 16.38,52.2 16,51.82 IC4.24 | IC5.16 21.22,51.3 v20.32,52.2
  Bottom 0.254: STM.96 21.07,45.34 | 21.07,45.34 21.07,46.85 23.62,49.4 23.62,50.93 22.35,52.2 v20.32,52.2 | R11.1 21.07,45.34
I2C2_SCL  (via drill 0.61)
  Top 0.254: R15.2 17.65,18.54 17.02,19.18 14.73,19.18 14.22,19.69 IC2.6 v14.22,24
  Bottom 0.254: STM.47 12.57,25.66 v14.22,24
I2C2_SDA  (via drill 0.61)
  Top 0.254: R16.1 15.71,20.49 15.49,20.7 IC2.5 v15.49,21.46
  Bottom 0.254: STM.48 12.07,24.76 15.37,21.46 v15.49,21.46
N$1
  Bottom 0.254: STM.12 29.89,35.09 31.44,36.65 Y1.2 31.59,39.81 C1.1
N$2
  Bottom 0.254: U$12.B+ 28.43,11.37 R2.1
N$3
  Top 0.254: IC4.10 9.59,50.27 C26.1
N$4
  Bottom 0.254: LD1.A 25.16,5.08 10.79,5.08 10.47,5.41 U1.31
N$5
  Bottom 0.254: R9.1 LD1.C
N$6
  Bottom 0.254: U$12.R+ 32.03,11.37 R6.1
N$7
  Bottom 0.254: U$12.G+ R3.1
N$8
  Top 0.254: IC4.20 17.12,49.77 C36.1
N$10
  Top 0.254: IC5.8 22.72,45.22 23.24,44.7 C27.1
N$12
  Top 0.254: IC5.10 26.02,47.38 C28.+
N$13
  Top 0.254: IC5.12 23.34,49.12 23.88,49.66 27.05,49.66 27.69,49.02 27.69,46.77 C27.2
N$29
  Bottom 0.254: STM.13 Y1.1 | Y1.1 | C20.1 31.93,34.1 Y1.1
N$31
  Bottom 0.254: STM.73 7.72,39.59 C17.1
N$32
  Bottom 0.254: STM.49 11.57,25.22 C15.1
RGB_CH1
  Bottom 0.254: STM.23 26.92,29.59 28.58,27.94 28.58,22.73 32,19.3 32,18.1 U$12.R-
RGB_CH2
  Bottom 0.254: STM.24 26.66,29.09 28.07,27.69 28.07,21.46 30.23,19.3 U$12.G- | U$12.G- 30.23,17.65 30.1,17.78 30.1,17.95 U$12.G-
RGB_CH3
  Bottom 0.254: STM.25 26.4,28.59 27.56,27.43 27.56,21.21 28.43,20.34 U$12.B-
SDIO_CLK  (via drill 0.61)
  Top 0.254: SDCARD2.5 6.83,34.32 7.87,33.27 7.87,29.59 6.6,28.32 v4.32,28.32
  Bottom 0.254: STM.80 13.07,44.08 10.79,46.35 6.35,46.35 1.52,41.53 1.52,33.91 3.3,32.13 3.3,29.34 v4.32,28.32
SDIO_CMD  (via drill 0.61)
  Top 0.254: v2.03,32.13 SDCARD2.3
  Bottom 0.254: STM.83 14.57,43.72 11.43,46.86 6.1,46.86 1.02,41.78 1.02,33.15 v2.03,32.13
SDIO_D0  (via drill 0.61)
  Top 0.254: SDCARD2.7 4.63,36.52 v4.45,36.7
  Bottom 0.254: v4.45,36.7 5.56,35.59 STM.65
SDIO_D1  (via drill 0.61)
  Top 0.254: SDCARD2.8 6.03,37.72 v6.35,37.72
  Bottom 0.254: STM.66 8.1,36.09 6.48,37.72 v6.35,37.72
SDIO_D2  (via drill 0.61)
  Top 0.254: 5.86,29.85 SDCARD2.1 4.52,29.92 v4.32,29.72
  Bottom 0.254: STM.78 12.07,43.55 10.29,45.34 6.86,45.34 2.54,41.02 2.54,34.42 5.33,31.62 5.33,30.73 v4.32,29.72
SDIO_D3  (via drill 0.61)
  Top 0.254: SDCARD2.2 4.41,31.02 v4.32,31.12
  Bottom 0.254: STM.79 12.57,43.82 10.54,45.85 6.6,45.85 2.03,41.27 2.03,34.16 4.32,31.88 v4.32,31.12
SDIO_DETECT  (via drill 0.61)
  Top 0.254: v16.13,30.73 16.13,31 SDCARD2.CD2
  Bottom 0.254: STM.54 15.49,30.09 v16.13,30.73
SW-!RESET
  Top 0.254: S1.P$2 12.7,6.2 12.7,5.97 12.32,5.59 JP4.5
  Bottom 0.254: STM.14 29.6,34.09 C13.1 33.91,29.78 33.91,5.84 33.02,4.95 25.78,4.95 25.4,4.57 14.22,4.57 JP4.5
SW_CLK
  Bottom 0.254: STM.76 11.07,43.79 10.03,44.83 7.11,44.83 3.05,40.77 3.05,34.67 6.22,31.5 6.22,22.86 4.45,21.08 4.45,4.7 8.25,0.89 13.08,0.89 JP4.4
SW_DIO  (via drill 0.61)
  Top 0.254: JP4.2 18.16,0.89 9.91,0.89 v8.76,2.03
  Bottom 0.254: STM.72 5.44,39.09 3.56,37.21 3.56,34.92 6.73,31.75 6.73,22.61 4.95,20.83 4.95,4.95 7.87,2.03 v8.76,2.03
USART3_RX
  Bottom 0.254: STM.56 7.85,31.09 7.24,30.48 7.24,21.97 5.97,20.7 U1.1
USART3_TX
  Bottom 0.254: STM.55 8.11,30.59 7.75,30.23 7.75,19.56 U1.2
VDD
  Top 1.778: 17.4,7.73 D1.A
  pour Top (isolate 0.762, no thermals): 18.42,6.1 18.03,5.71 18.03,2.41 16.76,2.41 16.76,5.21 15.87,6.1 15.87,9.78 18.42,9.78

### Text on the board
Top: SENSE v2.0
tNames: 0 | 1 | RX | TX | 2 | 3 | 4 | 5 | 6 | 7 | 8 | 9 | 10 | 11